# Altium project 超级电容组.PrjPcb
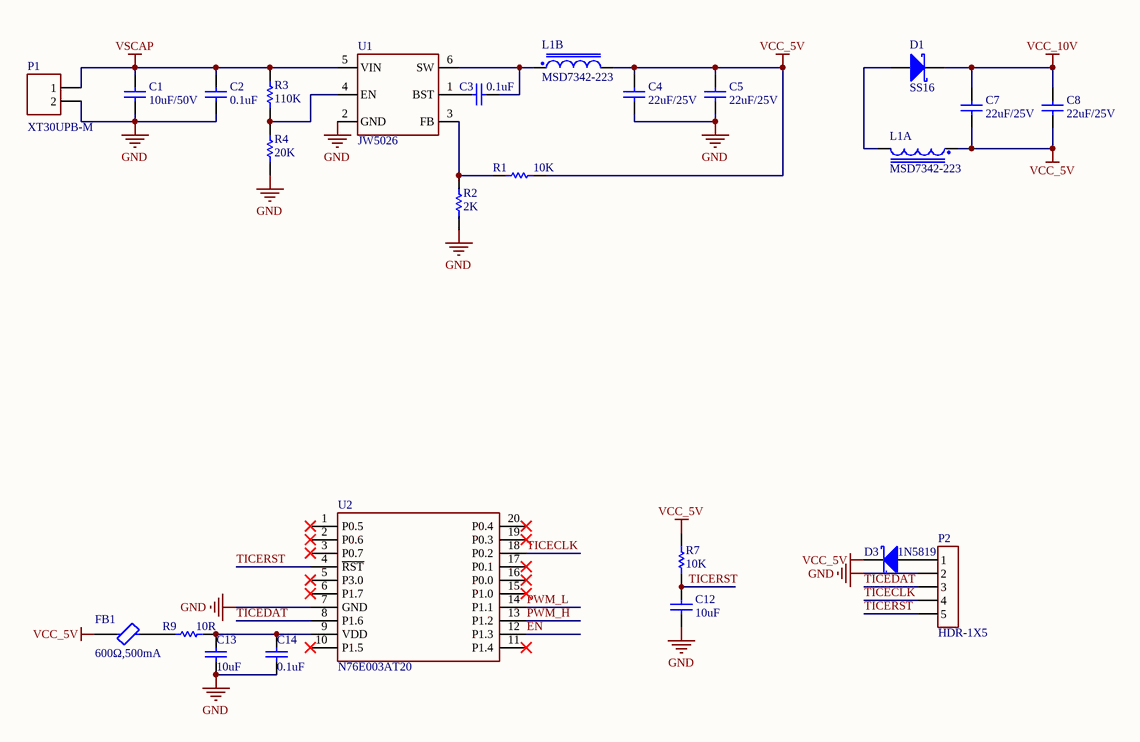
[diagram p0: MCU_POWER.SchDoc]
3 sheets, 131 parts. Net scope: global (net labels, ports and power ports of the same name join across sheets).
Board file: PCB1.PcbDoc
Sheets:
  MCU_POWER.SchDoc
  Gate_Drive.SchDoc
  SuperCap.SchDoc

## Sheet MCU_POWER.SchDoc
size A4; SheetNumber: 1; SheetTotal: 3; SPICEModelCacheYCYUXXQG: <root> / <DocumentId>YCYUXXQG</DocumentId> / </root>

### Parts
C1  10uF/50V  [C0805_M]
C2  0.1uF  [C0603_M]
C3  0.1uF  [C0603_M]
C4  22uF/25V  [C0805_M]
C5  22uF/25V  [C0805_M]
C7  22uF/25V  [C0805_M]
C8  22uF/25V  [C0805_M]
C12  10uF  [C0603_M]
C13  10uF  [C0603_M]
C14  0.1uF  [C0603_M]
D1  SS16  [SOD-123]
D3  1N5819  [SOD-323]
FB1  600Ω,500mA  [FB0603_M]
L1  MSD7342-223  [MSD7342]  (parts A,B of 2)
P1  XT30UPB-M  [XT30UPB-M]
P2  HDR-1X5  [HDR2.54-LI-5P]
R1  10K  [R0603_M]
R2  2K  [R0603_M]
R3  110K  [R0603_M]
R4  20K  [R0603_M]
R7  10K  [R0603_M]
R9  10R  [R0603_M]
U1  JW5026  [SOT23-6N]
U2  N76E003AT20  [TSSOP20_N]

### Nets
GND: C1.1 C2.1 C4.1 C5.1 C12.1 C13.1 C14.1 P1.2 P2.2 R2.2 R4.2 U1.2(GND) U2.7(GND)
VCC_5V: C4.2 C5.2 C7.1 C8.1 D3.2(K) FB1.1 L1.1 L1.4 R1.2 R7.1
VCC_10V: C7.2 C8.2 D1.2(K)
VSCAP: C1.2 C2.2 P1.1 R3.2 U1.5(VIN)
EN: U2.12(P1.3)
PWM_H: U2.13(P1.2)
PWM_L: U2.14(P1.1)
TICECLK: P2.4 U2.18(P0.2)
TICEDAT: P2.3 U2.8(P1.6)
TICERST: C12.2 P2.5 R7.2 U2.4(~{RST})
NetC3_1: C3.1 U1.1(BST)
NetC3_2: C3.2 L1.2 U1.6(SW)
NetC13_2: C13.2 C14.2 R9.2 U2.9(VDD)
NetD1_1: D1.1(A) L1.3
NetD3_1: D3.1(A) P2.1
NetFB1_2: FB1.2 R9.1
NetR1_1: R1.1 R2.1 U1.3(FB)
NetR3_1: R3.1 R4.1 U1.4(EN)

Not connected (* = marked no-connect by the designer): U2 1(P0.5)* 2(P0.6)* 3(P0.7)* 5(P3.0)* 6(P1.7)* 10(P1.5)* 11(P1.4)* 15(P1.0)* 16(P0.0)* 17(P0.1)* 19(P0.3)* 20(P0.4)*

### Library data of the parts
C1-C5 C7 C8 C12-C14 = Cap: Capacitor
D1 D3 = D Schottky: Schottky Diode; Published: 8-Jun-2000; LatestRevisionDate: 17-Jul-2002; LatestRevisionNote: Re-released for DXP Platform.; PackageReference: SMB; Publisher: Altium Limited; PackageDescription: DO-214-AA/SMB; 2 C-Bend Leads; Body 5.3 x 3.6 mm, inc. leads (LxW); Code_JEDEC: DO-214-AA
FB1 = Ferrite Bead
L1 = Coupled Inductor
P1 = XT30UPB-F: pin to pad: 1>+ 2>-
R1-R4 R7 R9 = Res1: Resistor

## Sheet Gate_Drive.SchDoc
size A4; SheetNumber: 2; SheetTotal: 3
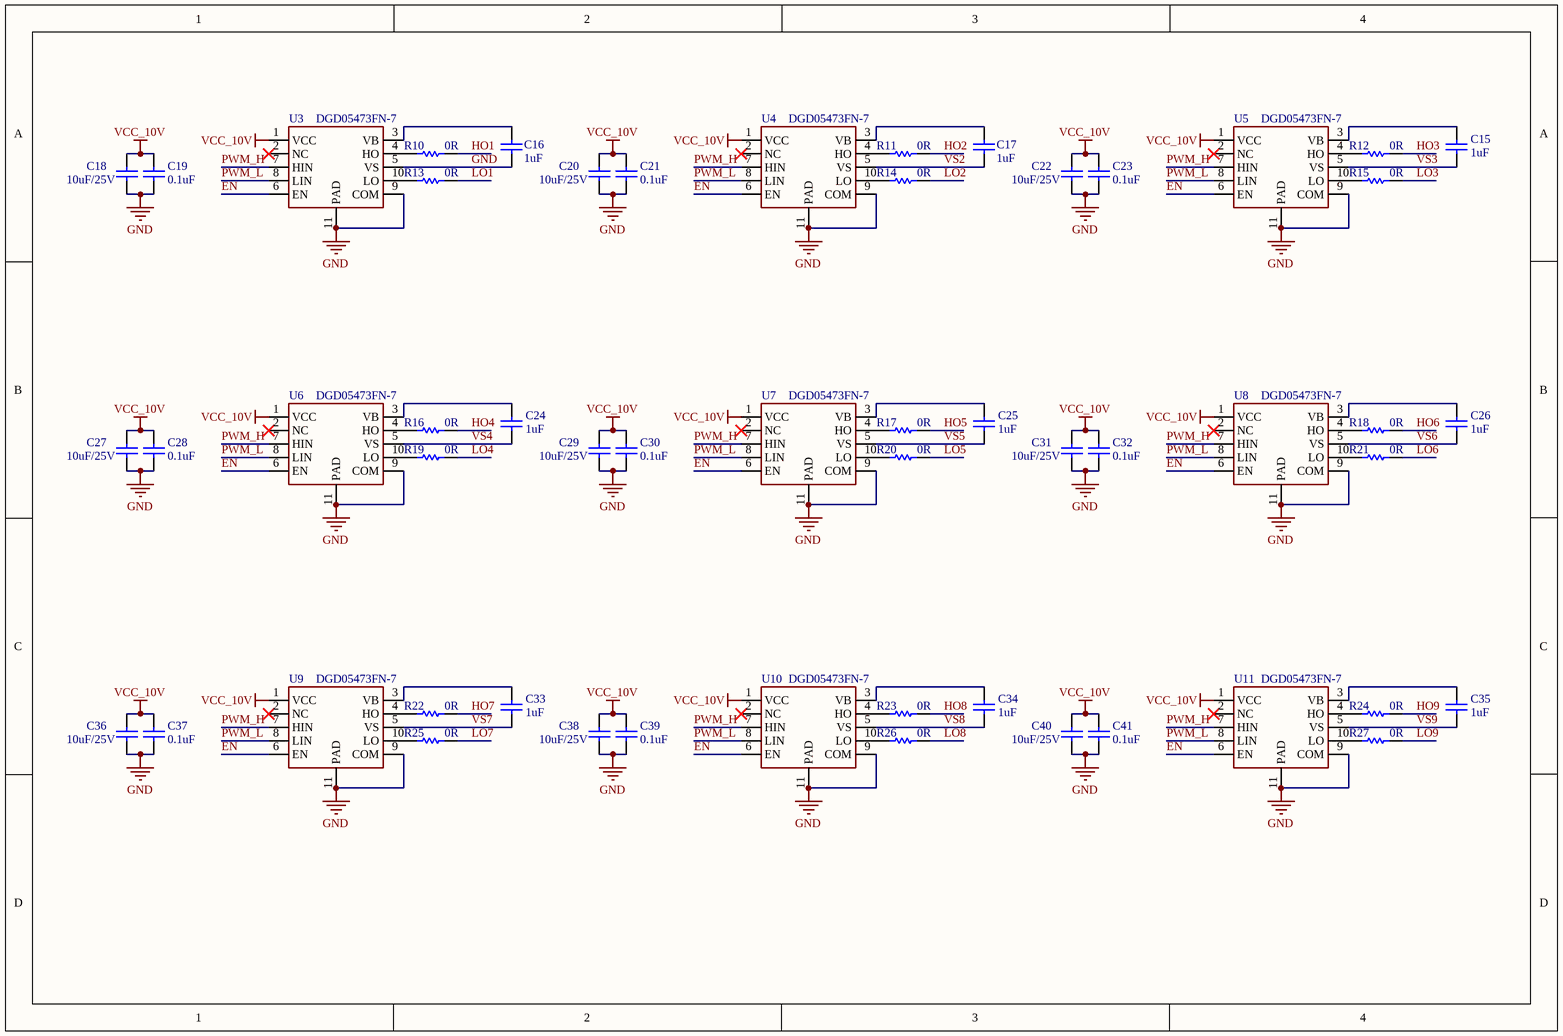
[diagram p1: Gate_Drive.SchDoc]

### Parts
C15  1uF  [C0603_M]
C16  1uF  [C0603_M]
C17  1uF  [C0603_M]
C18  10uF/25V  [C0603_M]
C19  0.1uF  [C0603_M]
C20  10uF/25V  [C0603_M]
C21  0.1uF  [C0603_M]
C22  10uF/25V  [C0603_M]
C23  0.1uF  [C0603_M]
C24  1uF  [C0603_M]
C25  1uF  [C0603_M]
C26  1uF  [C0603_M]
C27  10uF/25V  [C0603_M]
C28  0.1uF  [C0603_M]
C29  10uF/25V  [C0603_M]
C30  0.1uF  [C0603_M]
C31  10uF/25V  [C0603_M]
C32  0.1uF  [C0603_M]
C33  1uF  [C0603_M]
C34  1uF  [C0603_M]
C35  1uF  [C0603_M]
C36  10uF/25V  [C0603_M]
C37  0.1uF  [C0603_M]
C38  10uF/25V  [C0603_M]
C39  0.1uF  [C0603_M]
C40  10uF/25V  [C0603_M]
C41  0.1uF  [C0603_M]
R10  0R  [R0603_M]
R11  0R  [R0603_M]
R12  0R  [R0603_M]
R13  0R  [R0603_M]
R14  0R  [R0603_M]
R15  0R  [R0603_M]
R16  0R  [R0603_M]
R17  0R  [R0603_M]
R18  0R  [R0603_M]
R19  0R  [R0603_M]
R20  0R  [R0603_M]
R21  0R  [R0603_M]
R22  0R  [R0603_M]
R23  0R  [R0603_M]
R24  0R  [R0603_M]
R25  0R  [R0603_M]
R26  0R  [R0603_M]
R27  0R  [R0603_M]
U3  DGD05473FN-7  [W-DFN3030-10_L3.0-W3.0-P0.50-BL-EP]
U4  DGD05473FN-7  [W-DFN3030-10_L3.0-W3.0-P0.50-BL-EP]
U5  DGD05473FN-7  [W-DFN3030-10_L3.0-W3.0-P0.50-BL-EP]
U6  DGD05473FN-7  [W-DFN3030-10_L3.0-W3.0-P0.50-BL-EP]
U7  DGD05473FN-7  [W-DFN3030-10_L3.0-W3.0-P0.50-BL-EP]
U8  DGD05473FN-7  [W-DFN3030-10_L3.0-W3.0-P0.50-BL-EP]
U9  DGD05473FN-7  [W-DFN3030-10_L3.0-W3.0-P0.50-BL-EP]
U10  DGD05473FN-7  [W-DFN3030-10_L3.0-W3.0-P0.50-BL-EP]
U11  DGD05473FN-7  [W-DFN3030-10_L3.0-W3.0-P0.50-BL-EP]

### Nets
GND: C16.1 C18.2 C19.2 C20.2 C21.2 C22.2 C23.2 C27.2 C28.2 C29.2 C30.2 C31.2 C32.2 C36.2 C37.2 C38.2 C39.2 C40.2 C41.2 U3.5(VS) U3.9(COM) U3.11(PAD) U4.9(COM) U4.11(PAD) U5.9(COM) U5.11(PAD) U6.9(COM) U6.11(PAD) U7.9(COM) U7.11(PAD) U8.9(COM) U8.11(PAD) U9.9(COM) U9.11(PAD) U10.9(COM) U10.11(PAD) U11.9(COM) U11.11(PAD)
VCC_10V: C18.1 C19.1 C20.1 C21.1 C22.1 C23.1 C27.1 C28.1 C29.1 C30.1 C31.1 C32.1 C36.1 C37.1 C38.1 C39.1 C40.1 C41.1 U3.1(VCC) U4.1(VCC) U5.1(VCC) U6.1(VCC) U7.1(VCC) U8.1(VCC) U9.1(VCC) U10.1(VCC) U11.1(VCC)
EN: U3.6(EN) U4.6(EN) U5.6(EN) U6.6(EN) U7.6(EN) U8.6(EN) U9.6(EN) U10.6(EN) U11.6(EN)
HO1: R10.2
HO2: R11.2
HO3: R12.2
HO4: R16.2
HO5: R17.2
HO6: R18.2
HO7: R22.2
HO8: R23.2
HO9: R24.2
LO1: R13.2
LO2: R14.2
LO3: R15.2
LO4: R19.2
LO5: R20.2
LO6: R21.2
LO7: R25.2
LO8: R26.2
LO9: R27.2
PWM_H: U3.7(HIN) U4.7(HIN) U5.7(HIN) U6.7(HIN) U7.7(HIN) U8.7(HIN) U9.7(HIN) U10.7(HIN) U11.7(HIN)
PWM_L: U3.8(LIN) U4.8(LIN) U5.8(LIN) U6.8(LIN) U7.8(LIN) U8.8(LIN) U9.8(LIN) U10.8(LIN) U11.8(LIN)
VS2: C17.1 U4.5(VS)
VS3: C15.1 U5.5(VS)
VS4: C24.1 U6.5(VS)
VS5: C25.1 U7.5(VS)
VS6: C26.1 U8.5(VS)
VS7: C33.1 U9.5(VS)
VS8: C34.1 U10.5(VS)
VS9: C35.1 U11.5(VS)
NetC15_2: C15.2 U5.3(VB)
NetC16_2: C16.2 U3.3(VB)
NetC17_2: C17.2 U4.3(VB)
NetC24_2: C24.2 U6.3(VB)
NetC25_2: C25.2 U7.3(VB)
NetC26_2: C26.2 U8.3(VB)
NetC33_2: C33.2 U9.3(VB)
NetC34_2: C34.2 U10.3(VB)
NetC35_2: C35.2 U11.3(VB)
NetR10_1: R10.1 U3.4(HO)
NetR11_1: R11.1 U4.4(HO)
NetR12_1: R12.1 U5.4(HO)
NetR13_1: R13.1 U3.10(LO)
NetR14_1: R14.1 U4.10(LO)
NetR15_1: R15.1 U5.10(LO)
NetR16_1: R16.1 U6.4(HO)
NetR17_1: R17.1 U7.4(HO)
NetR18_1: R18.1 U8.4(HO)
NetR19_1: R19.1 U6.10(LO)
NetR20_1: R20.1 U7.10(LO)
NetR21_1: R21.1 U8.10(LO)
NetR22_1: R22.1 U9.4(HO)
NetR23_1: R23.1 U10.4(HO)
NetR24_1: R24.1 U11.4(HO)
NetR25_1: R25.1 U9.10(LO)
NetR26_1: R26.1 U10.10(LO)
NetR27_1: R27.1 U11.10(LO)

Not connected (* = marked no-connect by the designer): U3 2(NC)*; U4 2(NC)*; U5 2(NC)*; U6 2(NC)*; U7 2(NC)*; U8 2(NC)*; U9 2(NC)*; U10 2(NC)*; U11 2(NC)*

### Library data of the parts
C15-C17 C24-C26 C33-C35 = Cap: Capacitor; Published: 8-Jun-2000; LatestRevisionDate: 17-Jul-2002; LatestRevisionNote: Re-released for DXP Platform.; PackageReference: RAD-0.3; Publisher: Altium Limited; PackageDescription: Radial Cap, Thru-Hole; 2 Leads; 0.3 in Pin Spacing; Value: 1uF
C18-C23 C27-C32 C36-C41 = Cap: Capacitor; Value: 1uF; Published: 8-Jun-2000; LatestRevisionDate: 17-Jul-2002; LatestRevisionNote: Re-released for DXP Platform.; PackageReference: RAD-0.3; Publisher: Altium Limited; PackageDescription: Radial Cap, Thru-Hole; 2 Leads; 0.3 in Pin Spacing
R10-R27 = Res1: Resistor
U3-U11 = DGD05473

## Sheet SuperCap.SchDoc
size A4; SheetNumber: 3; SheetTotal: 3
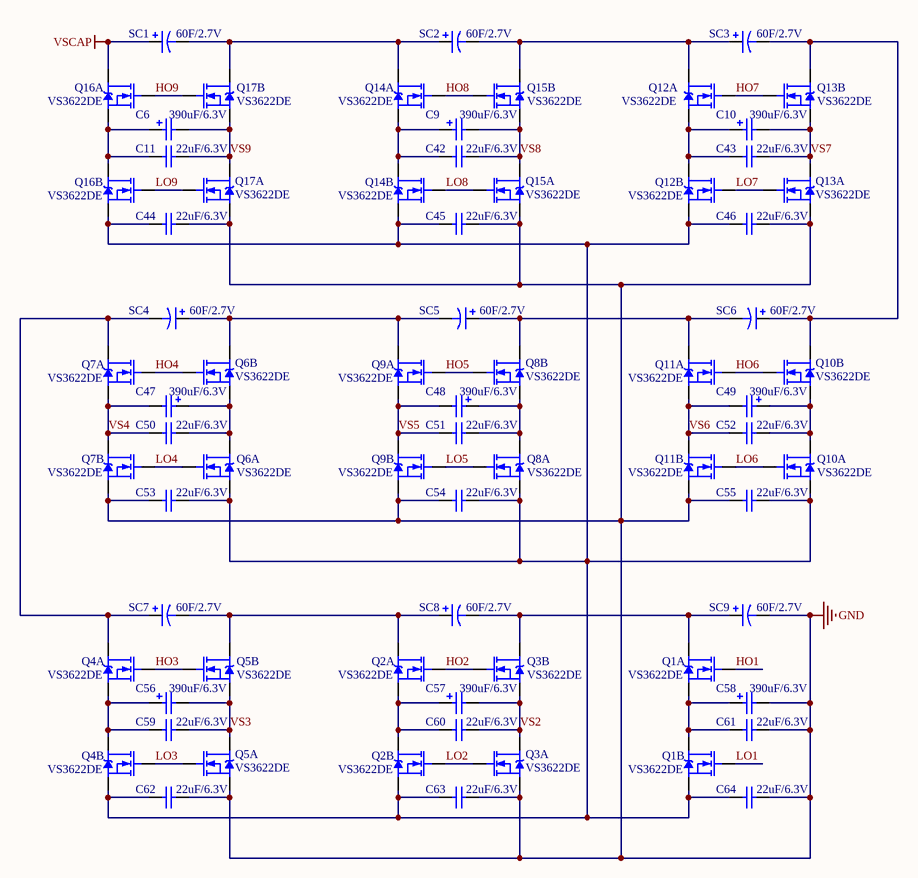
[diagram p2: SuperCap.SchDoc]

### Parts
C6  390uF/6.3V  [CS 8*12 - B]
C9  390uF/6.3V  [CS 8*12 - B]
C10  390uF/6.3V  [CS 8*12 - B]
C11  22uF/6.3V  [C0603_M]
C42  22uF/6.3V  [C0603_M]
C43  22uF/6.3V  [C0603_M]
C44  22uF/6.3V  [C0603_M]
C45  22uF/6.3V  [C0603_M]
C46  22uF/6.3V  [C0603_M]
C47  390uF/6.3V  [CS 8*12 - B]
C48  390uF/6.3V  [CS 8*12 - B]
C49  390uF/6.3V  [CS 8*12 - B]
C50  22uF/6.3V  [C0603_M]
C51  22uF/6.3V  [C0603_M]
C52  22uF/6.3V  [C0603_M]
C53  22uF/6.3V  [C0603_M]
C54  22uF/6.3V  [C0603_M]
C55  22uF/6.3V  [C0603_M]
C56  390uF/6.3V  [CS 8*12 - B]
C57  390uF/6.3V  [CS 8*12 - B]
C58  390uF/6.3V  [CS 8*12 - B]
C59  22uF/6.3V  [C0603_M]
C60  22uF/6.3V  [C0603_M]
C61  22uF/6.3V  [C0603_M]
C62  22uF/6.3V  [C0603_M]
C63  22uF/6.3V  [C0603_M]
C64  22uF/6.3V  [C0603_M]
Q1  VS3622DE  [PDFN3333-8_VS3622DE]  (parts A,B of 2)
Q2  VS3622DE  [PDFN3333-8_VS3622DE]  (parts A,B of 2)
Q3  VS3622DE  [PDFN3333-8_VS3622DE]  (parts A,B of 2)
Q4  VS3622DE  [PDFN3333-8_VS3622DE]  (parts A,B of 2)
Q5  VS3622DE  [PDFN3333-8_VS3622DE]  (parts A,B of 2)
Q6  VS3622DE  [PDFN3333-8_VS3622DE]  (parts A,B of 2)
Q7  VS3622DE  [PDFN3333-8_VS3622DE]  (parts A,B of 2)
Q8  VS3622DE  [PDFN3333-8_VS3622DE]  (parts A,B of 2)
Q9  VS3622DE  [PDFN3333-8_VS3622DE]  (parts A,B of 2)
Q10  VS3622DE  [PDFN3333-8_VS3622DE]  (parts A,B of 2)
Q11  VS3622DE  [PDFN3333-8_VS3622DE]  (parts A,B of 2)
Q12  VS3622DE  [PDFN3333-8_VS3622DE]  (parts A,B of 2)
Q13  VS3622DE  [PDFN3333-8_VS3622DE]  (parts A,B of 2)
Q14  VS3622DE  [PDFN3333-8_VS3622DE]  (parts A,B of 2)
Q15  VS3622DE  [PDFN3333-8_VS3622DE]  (parts A,B of 2)
Q16  VS3622DE  [PDFN3333-8_VS3622DE]  (parts A,B of 2)
Q17  VS3622DE  [PDFN3333-8_VS3622DE]  (parts A,B of 2)
SC1  60F/2.7V  [CE-7.5*18*35.5 - BK]
SC2  60F/2.7V  [CE-7.5*18*35.5 - BK]
SC3  60F/2.7V  [CE-7.5*18*35.5 - BK]
SC4  60F/2.7V  [CE-7.5*18*35.5 - BK]
SC5  60F/2.7V  [CE-7.5*18*35.5 - BK]
SC6  60F/2.7V  [CE-7.5*18*35.5 - BK]
SC7  60F/2.7V  [CE-7.5*18*35.5 - BK]
SC8  60F/2.7V  [CE-7.5*18*35.5 - BK]
SC9  60F/2.7V  [CE-7.5*18*35.5 - BK]

### Nets
GND: C44.2 C45.2 C46.2 C53.1 C54.1 C55.1 C58.2 C61.2 C62.2 C63.2 C64.1 Q3.S1 Q5.S1 Q7.S2 Q9.S2 Q11.S2 Q13.S1 Q15.S1 Q17.S1 SC9.2
VSCAP: Q16.D1 SC1.1
HO1: Q1.G1
HO2: Q2.G1 Q3.G2
HO3: Q4.G1 Q5.G2
HO4: Q6.G2 Q7.G1
HO5: Q8.G2 Q9.G1
HO6: Q10.G2 Q11.G1
HO7: Q12.G1 Q13.G2
HO8: Q14.G1 Q15.G2
HO9: Q16.G1 Q17.G2
LO1: Q1.G2
LO2: Q2.G2 Q3.G1
LO3: Q4.G2 Q5.G1
LO4: Q6.G1 Q7.G2
LO5: Q8.G1 Q9.G2
LO6: Q10.G1 Q11.G2
LO7: Q12.G2 Q13.G1
LO8: Q14.G2 Q15.G1
LO9: Q16.G2 Q17.G1
VS2: C57.2 C60.2 Q3.D1 Q3.S2
VS3: C56.2 C59.2 Q5.D1 Q5.S2
VS4: C47.2 C50.1 Q7.D2 Q7.S1
VS5: C48.2 C51.1 Q9.D2 Q9.S1
VS6: C49.2 C52.1 Q11.D2 Q11.S1
VS7: C10.2 C43.2 Q13.D1 Q13.S2
VS8: C9.2 C42.2 Q15.D1 Q15.S2
VS9: C6.2 C11.2 Q17.D1 Q17.S2
NetC6_1: C6.1 C11.1 Q16.D2 Q16.S1
NetC9_1: C9.1 C42.1 Q14.D2 Q14.S1
NetC10_1: C10.1 C43.1 Q12.D2 Q12.S1
NetC44_1: C44.1 C45.1 C46.1 C53.2 C54.2 C55.2 C62.1 C63.1 C64.2 Q1.S2 Q2.S2 Q4.S2 Q6.S1 Q8.S1 Q10.S1 Q12.S2 Q14.S2 Q16.S2
NetC47_1: C47.1 C50.2 Q6.D1 Q6.S2
NetC48_1: C48.1 C51.2 Q8.D1 Q8.S2
NetC49_1: C49.1 C52.2 Q10.D1 Q10.S2
NetC56_1: C56.1 C59.1 Q4.D2 Q4.S1
NetC57_1: C57.1 C60.1 Q2.D2 Q2.S1
NetC58_1: C58.1 C61.1 Q1.D2 Q1.S1
NetQ1_D1: Q1.D1 Q3.D2 SC8.2 SC9.1
NetQ2_D1: Q2.D1 Q5.D2 SC7.2 SC8.1
NetQ4_D1: Q4.D1 Q7.D1 SC4.2 SC7.1
NetQ6_D2: Q6.D2 Q9.D1 SC4.1 SC5.2
NetQ8_D2: Q8.D2 Q11.D1 SC5.1 SC6.2
NetQ10_D2: Q10.D2 Q13.D2 SC3.2 SC6.1
NetQ12_D1: Q12.D1 Q15.D2 SC2.2 SC3.1
NetQ14_D1: Q14.D1 Q17.D2 SC1.2 SC2.1

### Library data of the parts
C6 C9 C10 C47-C49 C56-C58 = Cap Pol2: Polarized Capacitor (Axial); Published: 8-Jun-2000; LatestRevisionDate: 17-Jul-2002; LatestRevisionNote: Re-released for DXP Platform.; Publisher: Altium Limited; PackageDescription: Polarized Capacitor; 2 Leads
C11 C42-C46 C50-C55 C59-C63 = Cap: Capacitor; Value: 1uF; Published: 8-Jun-2000; LatestRevisionDate: 17-Jul-2002; LatestRevisionNote: Re-released for DXP Platform.; PackageReference: RAD-0.3; Publisher: Altium Limited; PackageDescription: Radial Cap, Thru-Hole; 2 Leads; 0.3 in Pin Spacing
C64 = Cap: Capacitor
SC1-SC9 = Cap Pol1: Polarized Capacitor (Radial)

## Nets that join several sheets
GND: MCU_POWER (13 pins), Gate_Drive (38 pins), SuperCap (20 pins)
VCC_10V: MCU_POWER (C7.2 C8.2 D1.2), Gate_Drive (27 pins)
VSCAP: MCU_POWER (5 pins), SuperCap (Q16.D1 SC1.1)
EN: MCU_POWER (U2.12), Gate_Drive (9 pins)
HO1: Gate_Drive (R10.2), SuperCap (Q1.G1)
HO2: Gate_Drive (R11.2), SuperCap (Q2.G1 Q3.G2)
HO3: Gate_Drive (R12.2), SuperCap (Q4.G1 Q5.G2)
HO4: Gate_Drive (R16.2), SuperCap (Q6.G2 Q7.G1)
HO5: Gate_Drive (R17.2), SuperCap (Q8.G2 Q9.G1)
HO6: Gate_Drive (R18.2), SuperCap (Q10.G2 Q11.G1)
HO7: Gate_Drive (R22.2), SuperCap (Q12.G1 Q13.G2)
HO8: Gate_Drive (R23.2), SuperCap (Q14.G1 Q15.G2)
HO9: Gate_Drive (R24.2), SuperCap (Q16.G1 Q17.G2)
LO1: Gate_Drive (R13.2), SuperCap (Q1.G2)
LO2: Gate_Drive (R14.2), SuperCap (Q2.G2 Q3.G1)
LO3: Gate_Drive (R15.2), SuperCap (Q4.G2 Q5.G1)
LO4: Gate_Drive (R19.2), SuperCap (Q6.G1 Q7.G2)
LO5: Gate_Drive (R20.2), SuperCap (Q8.G1 Q9.G2)
LO6: Gate_Drive (R21.2), SuperCap (Q10.G1 Q11.G2)
LO7: Gate_Drive (R25.2), SuperCap (Q12.G2 Q13.G1)
LO8: Gate_Drive (R26.2), SuperCap (Q14.G2 Q15.G1)
LO9: Gate_Drive (R27.2), SuperCap (Q16.G2 Q17.G1)
PWM_H: MCU_POWER (U2.13), Gate_Drive (9 pins)
PWM_L: MCU_POWER (U2.14), Gate_Drive (9 pins)
VS2: Gate_Drive (C17.1 U4.5), SuperCap (C57.2 C60.2 Q3.D1 Q3.S2)
VS3: Gate_Drive (C15.1 U5.5), SuperCap (C56.2 C59.2 Q5.D1 Q5.S2)
VS4: Gate_Drive (C24.1 U6.5), SuperCap (C47.2 C50.1 Q7.D2 Q7.S1)
VS5: Gate_Drive (C25.1 U7.5), SuperCap (C48.2 C51.1 Q9.D2 Q9.S1)
VS6: Gate_Drive (C26.1 U8.5), SuperCap (C49.2 C52.1 Q11.D2 Q11.S1)
VS7: Gate_Drive (C33.1 U9.5), SuperCap (C10.2 C43.2 Q13.D1 Q13.S2)
VS8: Gate_Drive (C34.1 U10.5), SuperCap (C9.2 C42.2 Q15.D1 Q15.S2)
VS9: Gate_Drive (C35.1 U11.5), SuperCap (C6.2 C11.2 Q17.D1 Q17.S2)